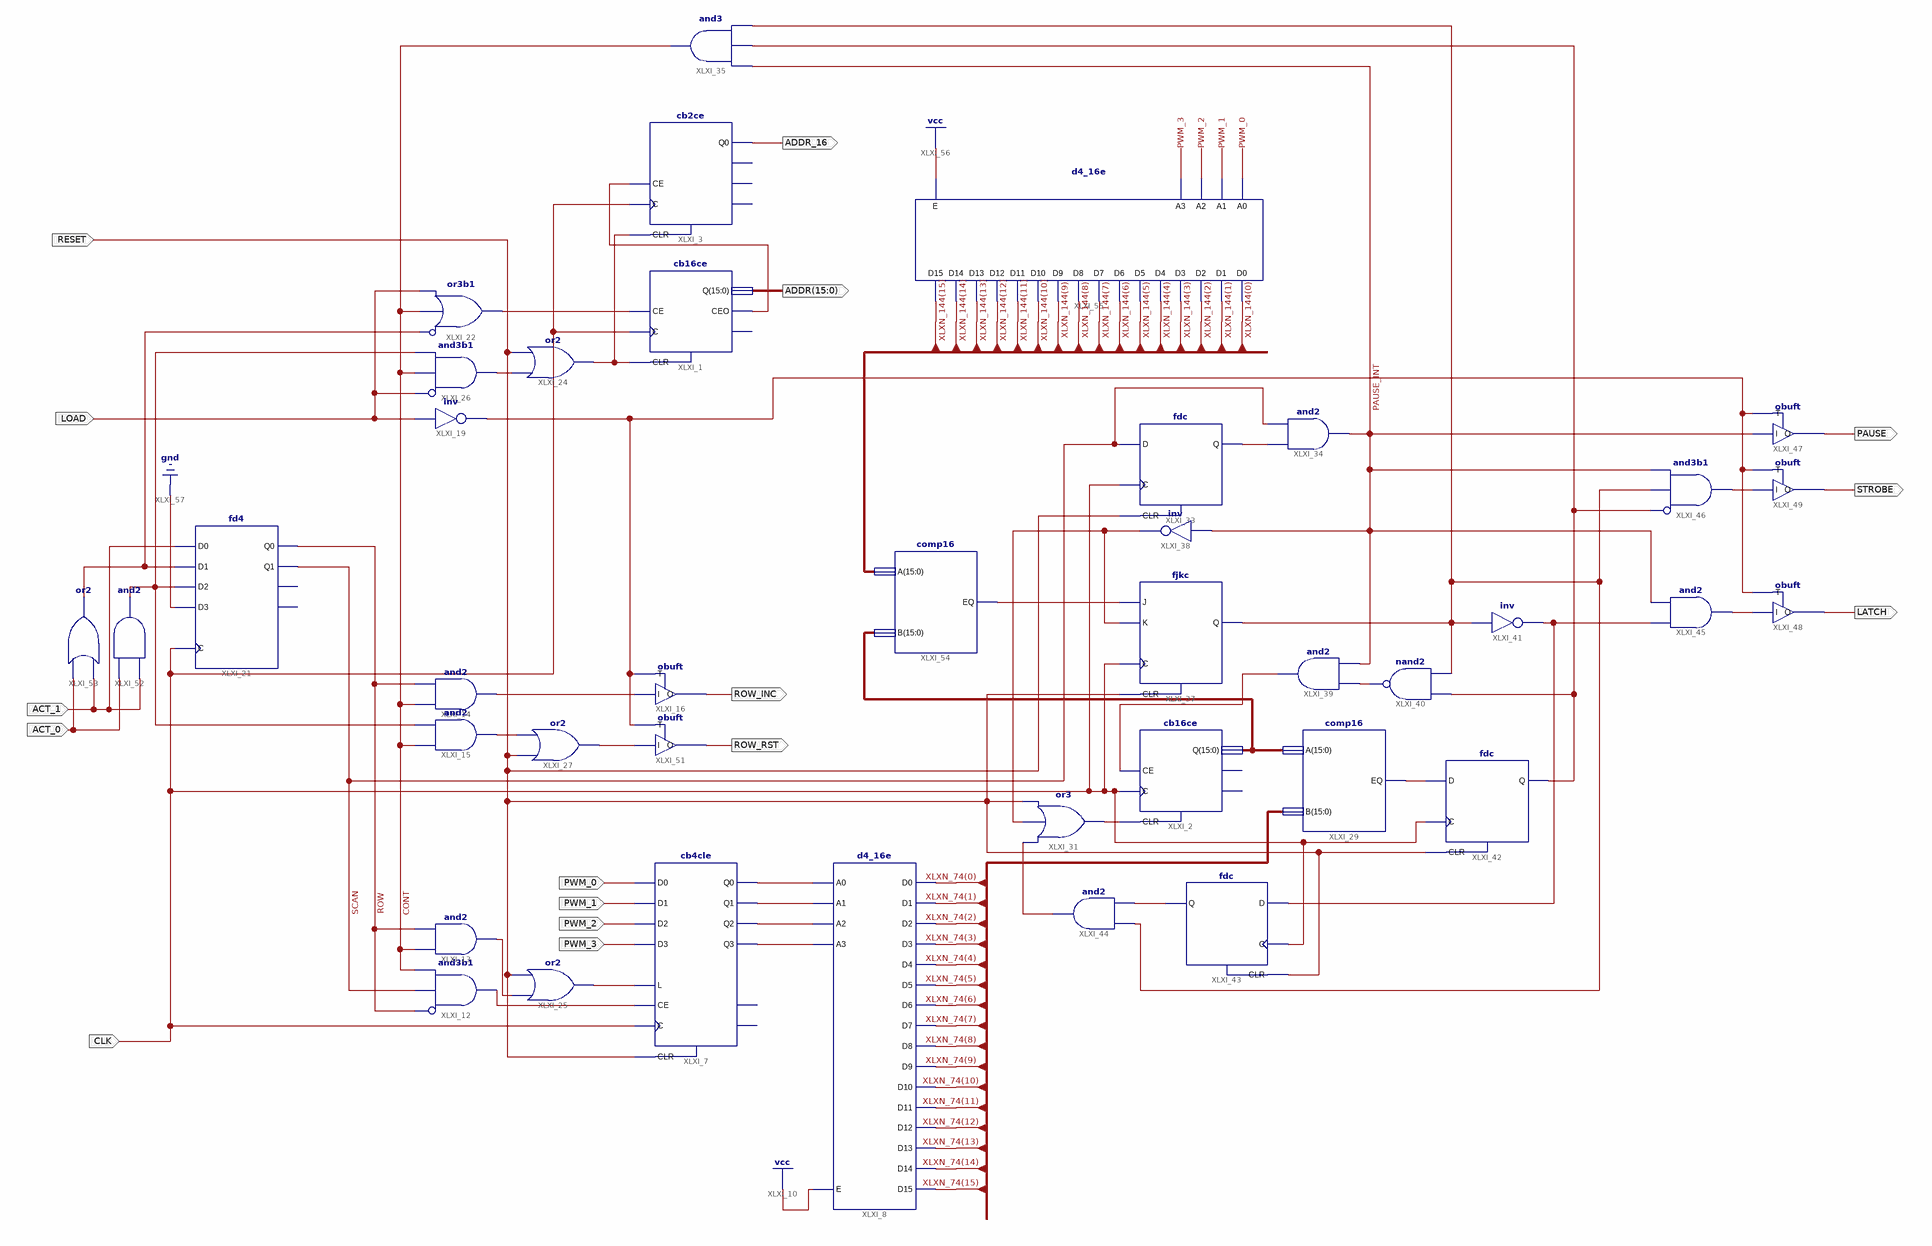
[diagram p0: schematic sheet 1]
// Xilinx ISE schematic driver.sch (xc9500xl) as structural Verilog: 40 symbols, 16 ports
module driver (
  input  PWM_0,
  input  PWM_1,
  input  PWM_2,
  input  PWM_3,
  input  CLK,
  input  ACT_1,
  input  LOAD,
  input  RESET,
  input  ACT_0,
  output ADDR_16,
  output [15:0] ADDR,
  output ROW_INC,
  output PAUSE,
  output STROBE,
  output LATCH,
  output ROW_RST
);

  wire CONT, IFRAME, ISCAN, PAUSE_INT, ROW, SCAN, XLXN_1, XLXN_2, XLXN_3, XLXN_4, XLXN_13, XLXN_27, XLXN_29,
       XLXN_30, XLXN_48, XLXN_64, XLXN_65, XLXN_66, XLXN_69, XLXN_70, XLXN_72, XLXN_93, XLXN_100, XLXN_101,
       XLXN_103, XLXN_109, XLXN_110, XLXN_115, XLXN_116, XLXN_117, XLXN_123, XLXN_127, XLXN_128, XLXN_134,
       XLXN_137;
  wire [15:0] XLXN_74, XLXN_138, XLXN_144;

  cb4cle XLXI_7 (
    .C(CLK), .CE(XLXN_13), .CLR(RESET), .D0(PWM_0), .D1(PWM_1), .D2(PWM_2), .D3(PWM_3), .L(XLXN_65),
    .Q0(XLXN_1), .Q1(XLXN_2), .Q2(XLXN_3), .Q3(XLXN_4));  // open: CEO, TC
  d4_16e XLXI_8 (
    .A0(XLXN_1), .A1(XLXN_2), .A2(XLXN_3), .A3(XLXN_4), .E(1'b1), .D0(XLXN_74[0]), .D1(XLXN_74[1]),
    .D10(XLXN_74[10]), .D11(XLXN_74[11]), .D12(XLXN_74[12]), .D13(XLXN_74[13]), .D14(XLXN_74[14]),
    .D15(XLXN_74[15]), .D2(XLXN_74[2]), .D3(XLXN_74[3]), .D4(XLXN_74[4]), .D5(XLXN_74[5]), .D6(XLXN_74[6]),
    .D7(XLXN_74[7]), .D8(XLXN_74[8]), .D9(XLXN_74[9]));
  and XLXI_12 (XLXN_13, ~ROW, SCAN, CONT);  // and3b1
  and XLXI_13 (XLXN_66, CONT, ROW);
  and XLXI_14 (XLXN_27, CONT, ROW);
  cb16ce XLXI_1 (.C(CLK), .CE(XLXN_48), .CLR(XLXN_30), .CEO(XLXN_29), .Q(ADDR));  // open: TC
  cb2ce XLXI_3 (.C(CLK), .CE(XLXN_29), .CLR(XLXN_30), .Q0(ADDR_16));  // open: CEO, Q1, TC
  fd4 XLXI_21 (.C(CLK), .D0(ACT_1), .D1(ISCAN), .D2(IFRAME), .D3(1'b0), .Q0(ROW), .Q1(SCAN));  // open: Q2, Q3
  or XLXI_22 (XLXN_48, ~ISCAN, CONT, LOAD);  // or3b1
  or XLXI_24 (XLXN_30, XLXN_64, RESET);
  and XLXI_26 (XLXN_64, ~LOAD, CONT, IFRAME);  // and3b1
  not XLXI_19 (XLXN_134, LOAD);
  or XLXI_25 (XLXN_65, XLXN_66, RESET);
  or XLXI_27 (XLXN_69, RESET, XLXN_70);
  and XLXI_15 (XLXN_70, CONT, IFRAME);
  cb16ce XLXI_2 (.C(CLK), .CE(XLXN_109), .CLR(XLXN_72), .Q(XLXN_138));  // open: CEO, TC
  or XLXI_31 (XLXN_72, XLXN_116, XLXN_103, RESET);
  comp16 XLXI_29 (.A(XLXN_138), .B(XLXN_74), .EQ(XLXN_100));
  fdc XLXI_33 (.C(CLK), .CLR(RESET), .D(SCAN), .Q(XLXN_93));
  and XLXI_34 (PAUSE_INT, XLXN_93, SCAN);
  and XLXI_35 (CONT, PAUSE_INT, XLXN_101, XLXN_123);
  fjkc XLXI_37 (.C(CLK), .CLR(RESET), .J(XLXN_137), .K(XLXN_103), .Q(XLXN_123));
  not XLXI_38 (XLXN_103, PAUSE_INT);
  and XLXI_39 (XLXN_109, XLXN_110, PAUSE_INT);
  nand XLXI_40 (XLXN_110, XLXN_101, XLXN_123);
  not XLXI_41 (XLXN_115, XLXN_123);
  fdc XLXI_42 (.C(CLK), .CLR(RESET), .D(XLXN_100), .Q(XLXN_101));
  fdc XLXI_43 (.C(CLK), .CLR(RESET), .D(XLXN_115), .Q(XLXN_117));
  and XLXI_44 (XLXN_116, XLXN_123, XLXN_117);
  and XLXI_45 (XLXN_127, XLXN_115, PAUSE_INT);
  and XLXI_46 (XLXN_128, ~XLXN_101, XLXN_123, PAUSE_INT);  // and3b1
  obuft XLXI_47 (.I(PAUSE_INT), .T(XLXN_134), .O(PAUSE));
  obuft XLXI_49 (.I(XLXN_128), .T(XLXN_134), .O(STROBE));
  obuft XLXI_48 (.I(XLXN_127), .T(XLXN_134), .O(LATCH));
  obuft XLXI_16 (.I(XLXN_27), .T(XLXN_134), .O(ROW_INC));
  obuft XLXI_51 (.I(XLXN_69), .T(XLXN_134), .O(ROW_RST));
  and XLXI_52 (IFRAME, ACT_1, ACT_0);
  or XLXI_53 (ISCAN, ACT_1, ACT_0);
  comp16 XLXI_54 (.A(XLXN_144), .B(XLXN_138), .EQ(XLXN_137));
  d4_16e XLXI_55 (
    .A0(PWM_0), .A1(PWM_1), .A2(PWM_2), .A3(PWM_3), .E(1'b1), .D0(XLXN_144[0]), .D1(XLXN_144[1]),
    .D10(XLXN_144[10]), .D11(XLXN_144[11]), .D12(XLXN_144[12]), .D13(XLXN_144[13]), .D14(XLXN_144[14]),
    .D15(XLXN_144[15]), .D2(XLXN_144[2]), .D3(XLXN_144[3]), .D4(XLXN_144[4]), .D5(XLXN_144[5]),
    .D6(XLXN_144[6]), .D7(XLXN_144[7]), .D8(XLXN_144[8]), .D9(XLXN_144[9]));
endmodule
